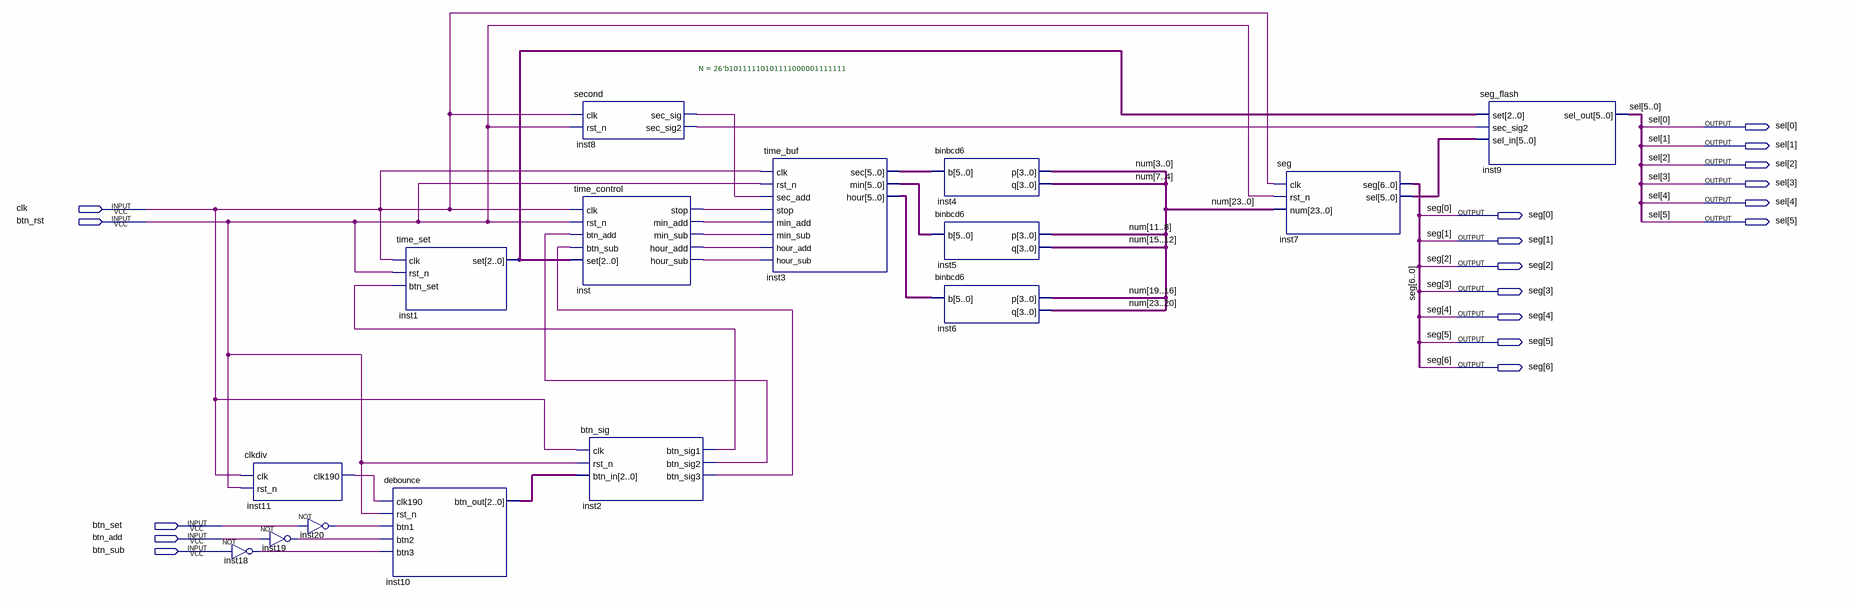
[diagram p0: schematic sheet]
// Quartus schematic my_clock.bdf as structural Verilog: 15 symbols, 18 pins
module my_clock (
  input  clk,
  input  btn_rst,
  input  btn_set,
  input  btn_add,
  input  btn_sub,
  output [5:0] sel,
  output [6:0] seg
);

  wire inst2_btn_sig1, inst2_btn_sig2, inst2_btn_sig3, inst8_sec_sig, inst8_sec_sig2, inst11_clk190,
       inst18_out, inst19_out, inst20_out, inst_hour_add, inst_hour_sub, inst_min_add, inst_min_sub,
       inst_stop;
  wire [2:0] inst1_set, inst10_btn_out;
  wire [5:0] inst3_hour, inst3_min, inst3_sec, inst7_sel;
  wire [23:0] num;

  clkdiv inst11 (.clk(clk), .rst_n(btn_rst), .clk190(inst11_clk190));
  not inst19 (inst19_out, btn_add);
  not inst18 (inst18_out, btn_sub);
  not inst20 (inst20_out, btn_set);
  time_set inst1 (.clk(clk), .rst_n(btn_rst), .btn_set(inst2_btn_sig1), .set(inst1_set));
  debounce inst10 (
    .clk190(inst11_clk190), .rst_n(btn_rst), .btn1(inst20_out), .btn2(inst19_out), .btn3(inst18_out),
    .btn_out(inst10_btn_out));
  second #(.N(26'b10111110101111000001111111)) inst8 (
    .clk(clk), .rst_n(btn_rst), .sec_sig(inst8_sec_sig), .sec_sig2(inst8_sec_sig2));
  time_control inst (
    .clk(clk), .rst_n(btn_rst), .btn_add(inst2_btn_sig2), .btn_sub(inst2_btn_sig3), .set(inst1_set),
    .stop(inst_stop), .min_add(inst_min_add), .min_sub(inst_min_sub), .hour_add(inst_hour_add),
    .hour_sub(inst_hour_sub));
  btn_sig inst2 (
    .clk(clk), .rst_n(btn_rst), .btn_in(inst10_btn_out), .btn_sig1(inst2_btn_sig1),
    .btn_sig2(inst2_btn_sig2), .btn_sig3(inst2_btn_sig3));
  time_buf inst3 (
    .clk(clk), .rst_n(btn_rst), .sec_add(inst8_sec_sig), .stop(inst_stop), .min_add(inst_min_add),
    .min_sub(inst_min_sub), .hour_add(inst_hour_add), .hour_sub(inst_hour_sub), .sec(inst3_sec),
    .min(inst3_min), .hour(inst3_hour));
  binbcd6 inst4 (.b(inst3_sec), .p(num[3:0]), .q(num[7:4]));
  binbcd6 inst5 (.b(inst3_min), .p(num[11:8]), .q(num[15:12]));
  binbcd6 inst6 (.b(inst3_hour), .p(num[19:16]), .q(num[23:20]));
  seg inst7 (.clk(clk), .rst_n(btn_rst), .num(num), .seg(seg), .sel(inst7_sel));
  seg_flash inst9 (.set(inst1_set), .sec_sig2(inst8_sec_sig2), .sel_in(inst7_sel), .sel_out(sel));
endmodule
